# EAGLE design noisemaker_3-0 (EAGLE 6.5.0)
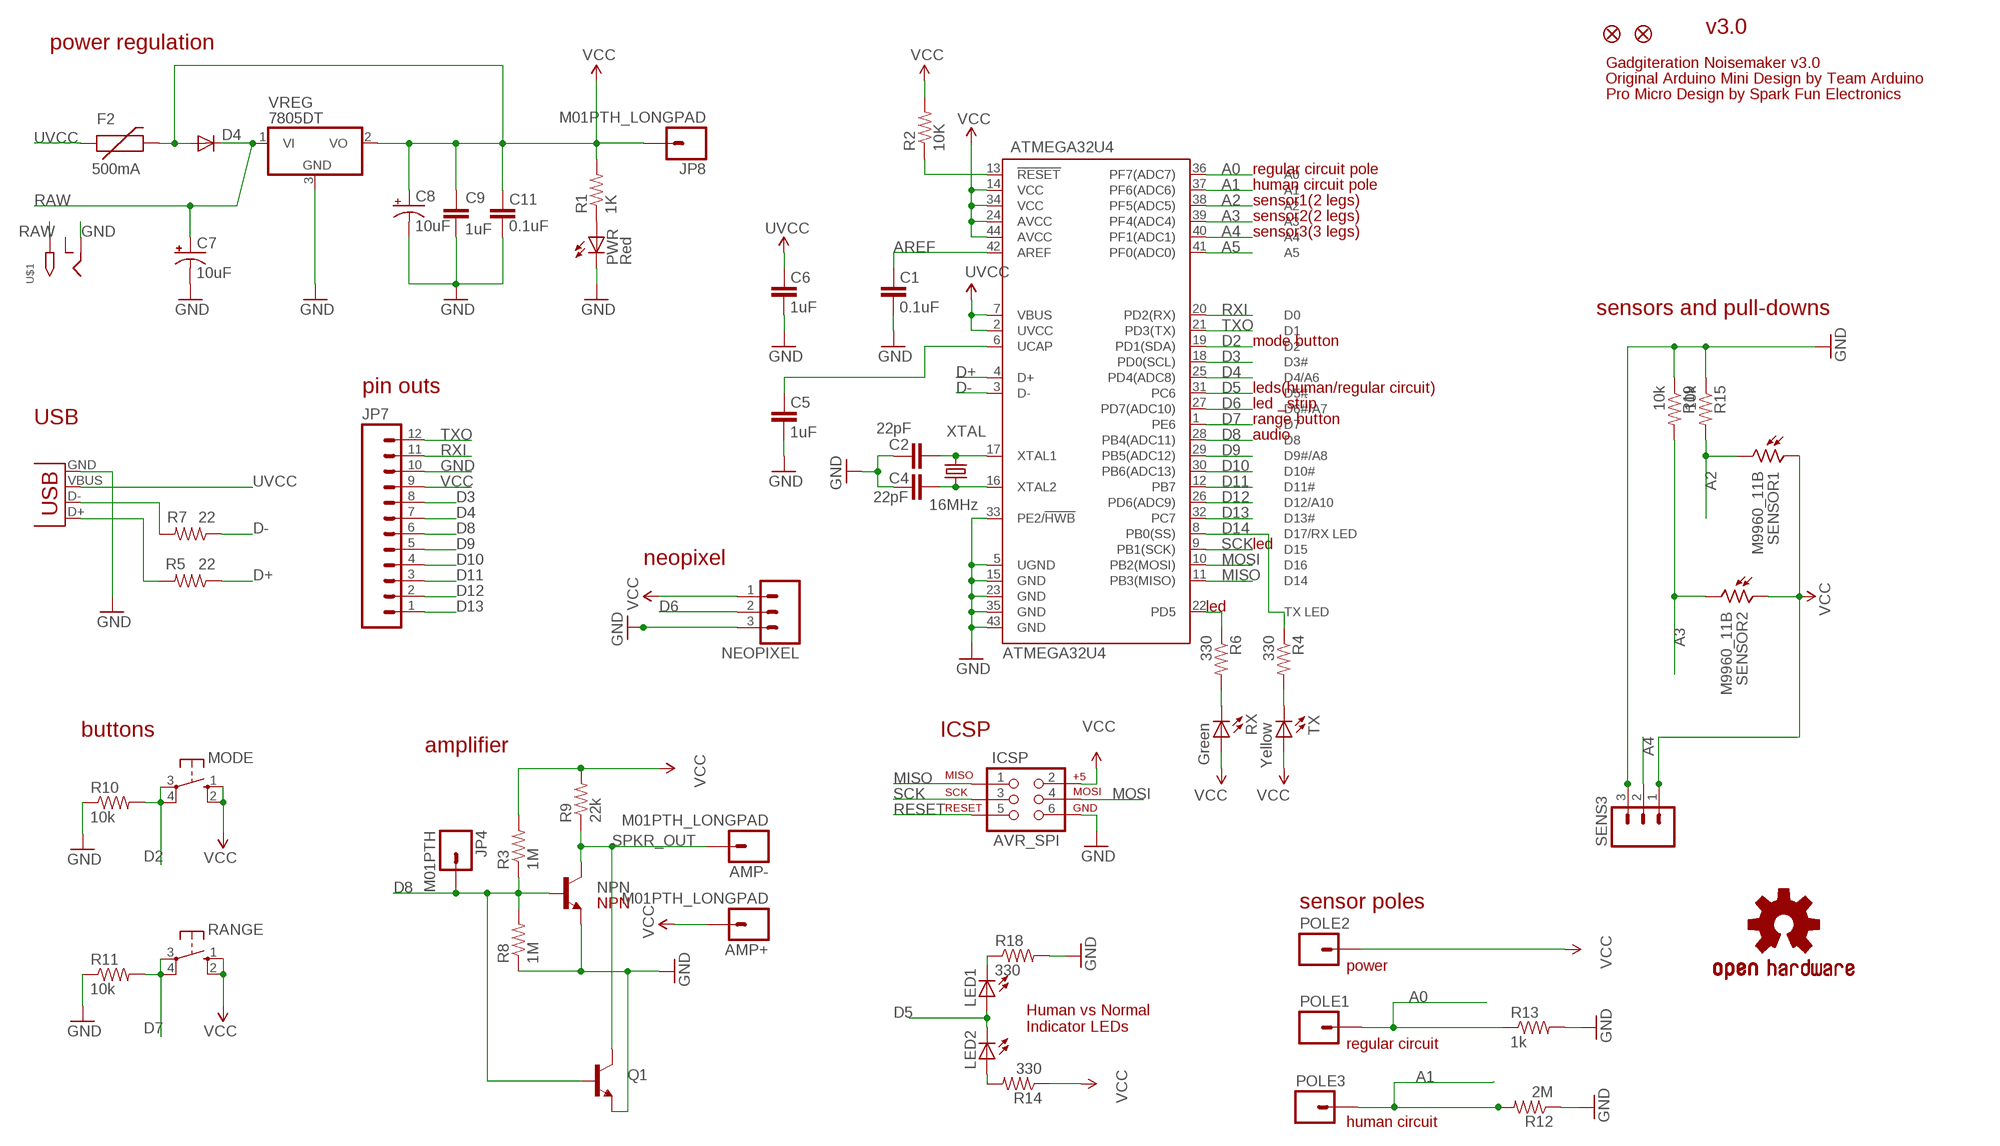
[diagram p0: schematic, sheet 1]

## Parts
AMP+  M01PTH_LONGPAD  [1X01_LONGPAD]
AMP-  M01PTH_LONGPAD  [1X01_LONGPAD]
ATMEGA32U4  ATMEGA32U4  ATMEGA32U4TQFP  [SPARKFUN-DIGITALIC_TQFP44]
C1  0.1uF  CAP1206  [1206]
C2  22pF  CAP0603-CAP  [0603-CAP]
C4  22pF  CAP0603-CAP  [0603-CAP]
C5  1uF  CAP1206  [1206]
C6  1uF  CAP1206  [1206]
C7  10uF  CAP_POL3528-KIT  [EIA3528-KIT]
C8  10uF  CAP_POL3528-KIT  [EIA3528-KIT]
C9  1uF  CAP1206  [1206]
C11  0.1uF  CAP1206  [1206]
D4  DIODESOD  [SOD-323]
F2  500mA  PTCSMD  [PTC-1206]
ICSP  AVR_SPI  AVR_SPI_PRG_6PTH  [2X3]
JP1  FIDUCIALUFIDUCIAL  [MICRO-FIDUCIAL]
JP2  FIDUCIALUFIDUCIAL  [MICRO-FIDUCIAL]
JP3  USB-B  USBPTH  [USB-B-PTH]
JP4  M01PTH  [1X01]
JP7  M12PTH  [1X12]
JP8  M01PTH_LONGPAD  [1X01_LONGPAD]
LED1  LED3MM  [LED3MM]
LED2  LED3MM  [LED3MM]
LOGO1  OSHW-LOGOM  [OSHW-LOGO-M]
MODE  10-XX  [B3F-10XX]
NEOPIXEL  M03LONGPADS  [1X03_LONGPADS]
NPN  TRANSISTOR_NPNSOT23-3  [SOT23-3]
POLE1  M01PTH_LONGPAD  [1X01_LONGPAD]
POLE2  M01PTH_LONGPAD  [1X01_LONGPAD]
POLE3  M01PTH_LONGPAD  [1X01_LONGPAD]
PWR  Red  LEDCHIPLED_1206  [CHIPLED_1206]
Q1  TRANSISTOR_NPNTO-92-AMMO  [TO-92-AMMO]
R1  1K  RESISTOR1206  [1206]
R2  10K  RESISTOR1206  [1206]
R3  1M  RESISTOR1206  [1206]
R4  330  RESISTOR1206  [1206]
R5  22  RESISTOR1206  [1206]
R6  330  RESISTOR1206  [1206]
R7  22  RESISTOR1206  [1206]
R8  1M  RESISTOR1206  [1206]
R9  22k  RESISTOR1206  [1206]
R10  10k  RESISTOR1206  [1206]
R11  10k  RESISTOR1206  [1206]
R12  2M  RESISTOR1206  [1206]
R13  1k  RESISTOR1206  [1206]
R14  330  RESISTOR1206  [1206]
R15  10k  RESISTOR1206  [1206]
R18  330  RESISTOR1206  [1206]
R19  10k  RESISTOR1206  [1206]
RANGE  10-XX  [B3F-10XX]
RX  Green  LEDCHIPLED_1206  [CHIPLED_1206]
SENS3  M03POGO_PIN_HOLES_ONLY  [1X03_PP_HOLES_ONLY]
SENSOR1  M9960_11B  [M9960]
SENSOR2  M9960_11B  [M9960]
TX  Yellow  LEDCHIPLED_1206  [CHIPLED_1206]
U$1  2.1MMJACKTHM  [PJ-102A]
VREG  7805DT  [TO252]
XTAL  16MHz  CRYSTAL5X3  [CRYSTAL-SMD-5X3]

## Nets
A0: ATMEGA32U4.36(PF7(ADC7)) POLE1.1 R13.1
A1: ATMEGA32U4.37(PF6(ADC6)) POLE3.1 R12.2
A2: ATMEGA32U4.38(PF5(ADC5)) R15.2 SENSOR1.2
A3: ATMEGA32U4.39(PF4(ADC4)) R19.2 SENSOR2.2
A4: ATMEGA32U4.40(PF1(ADC1)) SENS3.2
A5: ATMEGA32U4.41(PF0(ADC0))
AREF: ATMEGA32U4.42(AREF) C1.2
D2: ATMEGA32U4.19(PD1(SDA)) MODE.3(P) MODE.4(P1) R10.2
D3: ATMEGA32U4.18(PD0(SCL)) JP7.8
D4: ATMEGA32U4.25(PD4(ADC8)) JP7.7
D5: ATMEGA32U4.31(PC6) LED1.A LED2.K(C)
D6: ATMEGA32U4.27(PD7(ADC10)) NEOPIXEL.2
D7: ATMEGA32U4.1(PE6) R11.2 RANGE.3(P) RANGE.4(P1)
D8: ATMEGA32U4.28(PB4(ADC11)) JP4.1 JP7.6 NPN.1(B) Q1.2(B) R3.1 R8.2
D9: ATMEGA32U4.29(PB5(ADC12)) JP7.5
D10: ATMEGA32U4.30(PB6(ADC13)) JP7.4
D11: ATMEGA32U4.12(PB7) JP7.3
D12: ATMEGA32U4.26(PD6(ADC9)) JP7.2
D13: ATMEGA32U4.32(PC7) JP7.1
D14: ATMEGA32U4.8(PB0(SS)) R4.1
D+: ATMEGA32U4.4(D+) R5.1
D-: ATMEGA32U4.3(D-) R7.1
GND [vcc]: ATMEGA32U4.5(UGND) ATMEGA32U4.15(GND) ATMEGA32U4.23(GND) ATMEGA32U4.33(PE2/!HWB) ATMEGA32U4.35(GND) ATMEGA32U4.43(GND) C1.1 C2.2 C4.2 C5.1 C6.1 C7.C(-) C8.C(-) C9.2 C11.1 ICSP.6 JP3.GND JP7.10 NEOPIXEL.3 NPN.2(E) PWR.C Q1.1(E) R8.1 R10.1 R11.1 R12.1 R13.2 R15.1 R18.2 R19.1 SENS3.3 U$1.RING VREG.3(GND)
MISO: ATMEGA32U4.11(PB3(MISO)) ICSP.1
MOSI: ATMEGA32U4.10(PB2(MOSI)) ICSP.4
N$1: ATMEGA32U4.16(XTAL2) C4.1 XTAL.1
N$2: ATMEGA32U4.17(XTAL1) C2.1 XTAL.3
N$4: ATMEGA32U4.6(UCAP) C5.2
N$5: R4.2 TX.C
N$7: R6.2 RX.C
N$8: JP3.D+ R5.2
N$9: JP3.D- R7.2
N$10: PWR.A R1.1
N$12: LED1.K(C) R18.1
N$13: LED2.A R14.2
RAW [vcc]: C7.A(+) D4.1(C) U$1.TIP VREG.1(VI)
RESET: ATMEGA32U4.13(!RESET) ICSP.5 R2.1
RXI: ATMEGA32U4.20(PD2(RX)) JP7.11
SCK: ATMEGA32U4.9(PB1(SCK)) ICSP.3
SPKR_OUT: AMP-.1 NPN.3(C) Q1.3(C) R9.1
TXLED: ATMEGA32U4.22(PD5) R6.1
TXO: ATMEGA32U4.21(PD3(TX)) JP7.12
UVCC: ATMEGA32U4.2(UVCC) ATMEGA32U4.7(VBUS) C6.2 F2.1 JP3.VBUS
VCC: AMP+.1 ATMEGA32U4.14(VCC) ATMEGA32U4.24(AVCC) ATMEGA32U4.34(VCC) ATMEGA32U4.44(AVCC) C8.A(+) C9.1 C11.2 D4.2(A) F2.2 ICSP.2 JP7.9 JP8.1 MODE.1(S) MODE.2(S1) NEOPIXEL.1 POLE2.1 R1.2 R2.2 R3.2 R9.2 R14.1 RANGE.1(S) RANGE.2(S1) RX.A SENS3.1 SENSOR1.1 SENSOR2.1 TX.A VREG.2(VO)
Unconnected: U$1.RING_SW

## Notes on the sheet
- v3.0
- power regulation
- Gadgiteration Noisemaker v3.0
- Original Arduino Mini Design by Team Arduino
- Pro Micro Design by Spark Fun Electronics
- regular circuit pole
- human circuit pole
- sensor1(2 legs)
- sensor2(2 legs)
- sensor3(3 legs)
- sensors and pull-downs
- mode button
- pin outs | leds(human/regular circuit)
- led _strip
- USB | range button
- audio
- led
- neopixel
- led
- buttons | ICSP
- amplifier
- NPN | sensor poles
- power
- Human vs Normal 
  Indicator LEDs
- regular circuit
- human circuit

## Library data of the parts
AMP+ AMP- JP4 JP8 POLE1-POLE3 = SparkFun-Connectors:M01: Header 1 Standard 1-pin 0.1" header. Use with straight break away headers (SKU : PRT-00116), right angle break away headers (PRT-00553), swiss pins (PRT-00743), machine pins (PRT-00117), and female headers (PRT-00115).
ATMEGA32U4 = SparkFun-DigitalIC:ATMEGA32U4: Atmel 44-pin 8-bit Microcontroller with 32KBytes of ISP Flash and USB Controller
C1 C5 C6 C9 C11 = SparkFun-Capacitors:CAP: Capacitor Standard 0603 ceramic capacitor, and 0.1" leaded capacitor.
C2 C4 = SparkFun:CAP: Capacitor Standard 0603 ceramic capacitor, and 0.1" leaded capacitor.
C7 C8 = SparkFun-Capacitors:CAP_POL: Capacitor Polarized These are standard SMD and PTH capacitors. Normally 10uF, 47uF, and 100uF in electrolytic and tantalum varieties. Always verify the external diameter of the through hole cap, it varies with capacity, voltage, and manufacturer. The EIA devices should be standard.
D4 = SparkFun:DIODE: Diode These are standard reverse protection diodes and small signal diodes. SMA package can handle up to about 1A. SOD-323 can handle about 200mA. What the SOD-323 package when ordering, there are some mfgs out there that are 5-pin packages.
F2 = SparkFun:PTC: Resettable Fuse PTC Resettable Fuse. Spark Fun Electronics SKU : COM-08357
ICSP = SparkFun:AVR_SPI_PRG_6: AVR ISP 6 Pin This is the reduced ISP connector for AVR programming. Common on Arduino. This footprint will take up less PCB space and can be used with a 10-pin to 6-pin adapter such as SKU: BOB-08508
JP1 JP2 = SparkFun:FIDUCIAL: Fiducial Alignment Points Various fiducial points for machine vision alignment.
JP3 = SparkFun-Connectors:USB: USB Connectors USB-B-PTH is fully proven SKU : PRT-00139/CONN-08278 USB-miniB is fully proven SKU : PRT-00587 USB-A-PCB is untested. USB-A-H is throughly reviewed, but untested. Spark Fun Electronics SKU : PRT-00437 USB-B-SMT is throughly reviewed, but untested. Needs silkscreen touching up. USB-A-S has not been used/tested USB-MB-H has not been used/tested USB-MICROB has been used. CONN-09505; PROD_ID: CONN-08278
JP7 = SparkFun:M12: Header 12 Standard 12-pin 0.1" header. Use with straight break away headers (SKU : PRT-00116), right angle break away headers (PRT-00553), swiss pins (PRT-00743), machine pins (PRT-00117), and female headers (PRT-00115).
LED1 LED2 PWR RX TX = adafruit:LED: LED OSRAM: - CHIPLED LG R971, LG N971, LY N971, LG Q971, LY Q971, LO R971, LY R971 LH N974, LH R974 LS Q976, LO Q976, LY Q976 LO Q996 - Hyper CHIPLED LW Q18S LB Q993, LB Q99A, LB R99A - SideLED LS A670, LO A670, LY A670, LG A670, LP A670 LB A673, LV A673, LT A673, LW A673 LH A674 LY A675 LS A676, LA A676, LO A676, LY A676, LW A676 LS A679, LY A679, LG A679 - Hyper Micro SIDELED® LS Y876, LA Y876, LO Y876, LY Y876 LT Y87S - SmartLED LW L88C, LW L88S LB L89C, LB L89S, LG L890 LS L89K, LO L89K, LY L89K LS L896, LA L896, LO L896, LY L896 - TOPLED LS T670, LO T670, LY T670, LG T670, LP T670 LSG T670, LSP T670, LSY T670, LOP T670, LYG T670 LG T671, LOG T671, LSG T671 LB T673, LV T673, LT T673, LW T673 LH T674 LS T676, LA T676, LO T676, LY T676, LB T676, LH T676, LSB T676, LW T676 LB T67C, LV T67C, LT T67C, LS T67K, LO T67K, LY T67K, LW E67C LS E67B, LA E67B, LO E67B, LY E67B, LB E67C, LV E67C, LT E67C LW T67C LS T679, LY T679, LG T679 LS T770, LO T770, LY T770, LG T770, LP T770 LB T773, LV T773, LT T773, LW T773 LH T774 LS E675, LA E675, LY E675, LS T675 LS T776, LA T776, LO T776, LY T776, LB T776 LHGB T686 LT T68C, LB T68C - Hyper Mini TOPLED® LB M676 - Mini TOPLED Santana® LG M470 LS M47K, LO M47K, LY M47K Source: http://www.osram.convergy.de/
LOGO1 = SparkFun-Aesthetics:OSHW-LOGO: Open Source Hardware Logo This logo indicates the piece of hardware it is found on incorporates a OSHW license and/or adheres to the definition of open source hardware found here: http://freedomdefined.org/OSHW
MODE RANGE = switch-omron:10-XX: OMRON SWITCH
NEOPIXEL SENS3 = SparkFun-Connectors:M03: Header 3 Standard 3-pin 0.1" header. Use with straight break away headers (SKU : PRT-00116), right angle break away headers (PRT-00553), swiss pins (PRT-00743), machine pins (PRT-00117), and female headers (PRT-00115). Molex polarized connector foot print use with SKU : PRT-08232 with associated crimp pins and housings.
NPN Q1 = SparkFun-DiscreteSemi:TRANSISTOR_NPN: Generic NPN BJT. MMBT2222 is the common NPN we use. Double check against datasheet- not all devices are the same!
R1-R15 R18 R19 = SparkFun-Passives:RESISTOR: Resistor Basic schematic elements and footprints for 0603, 1206, and PTH resistors.
SENSOR1 SENSOR2 = photo-elements:M9960_11: Photo Sensor Beacon Light, Photometer Applications Source: http://optoelectronics.perkinelmer.com/content/Datasheets/DTS_M9960.pdf
U$1 = adafruit:2.1MMJACK: 2.1mm x 5.5mm THM DC jack with internal switch. Digikey part #PJ-102A, 4UCON part #05537 2.1mm x 5.5mm SMT DC jack with internal switch. Digikey part #PJ-002A-SMT, 4UCON part #03267 By microbuilder.eu & adafruit.com
VREG = linear:78*: Positive VOLTAGE REGULATOR Source: http://cache.national.com/ds/LM/LM78L05.pdf http://www.fairchildsemi.com/ds/LM/LM7805.pdf
XTAL = SparkFun:CRYSTAL: Crystals Various standard crystals. Proven footprints. Spark Fun Electronics SKU : COM-00534

## Net classes
0 default: width 0.203 mm

## Board
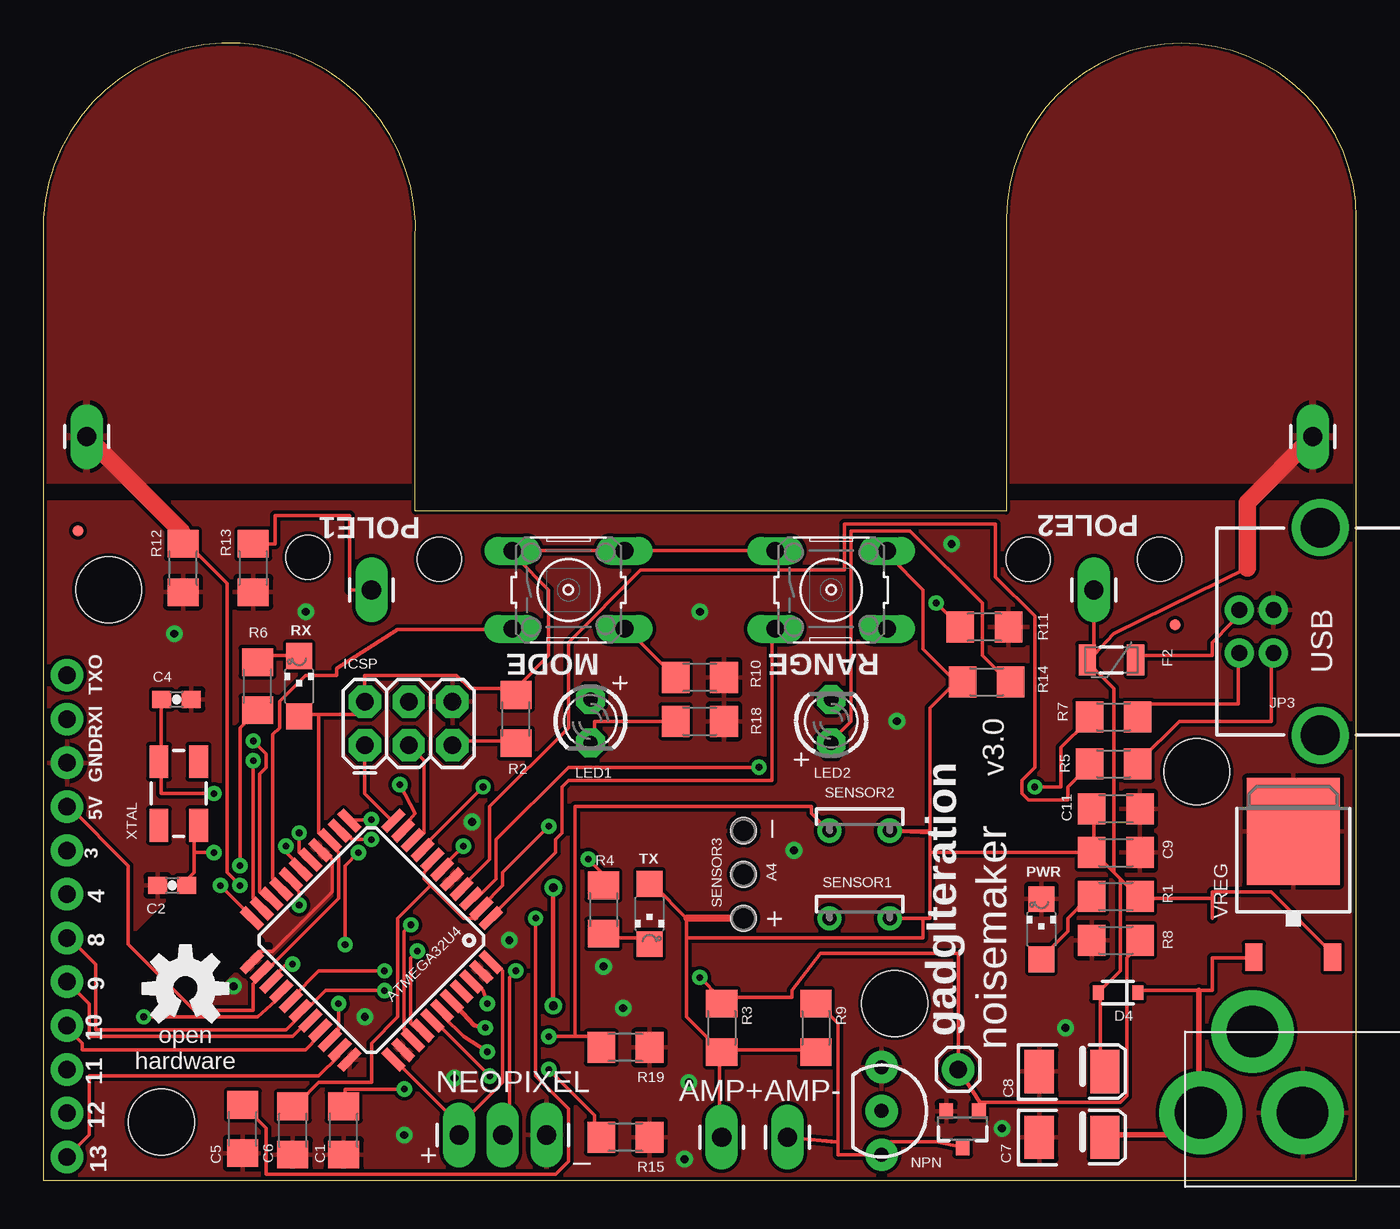
[diagram p1: board, top side]
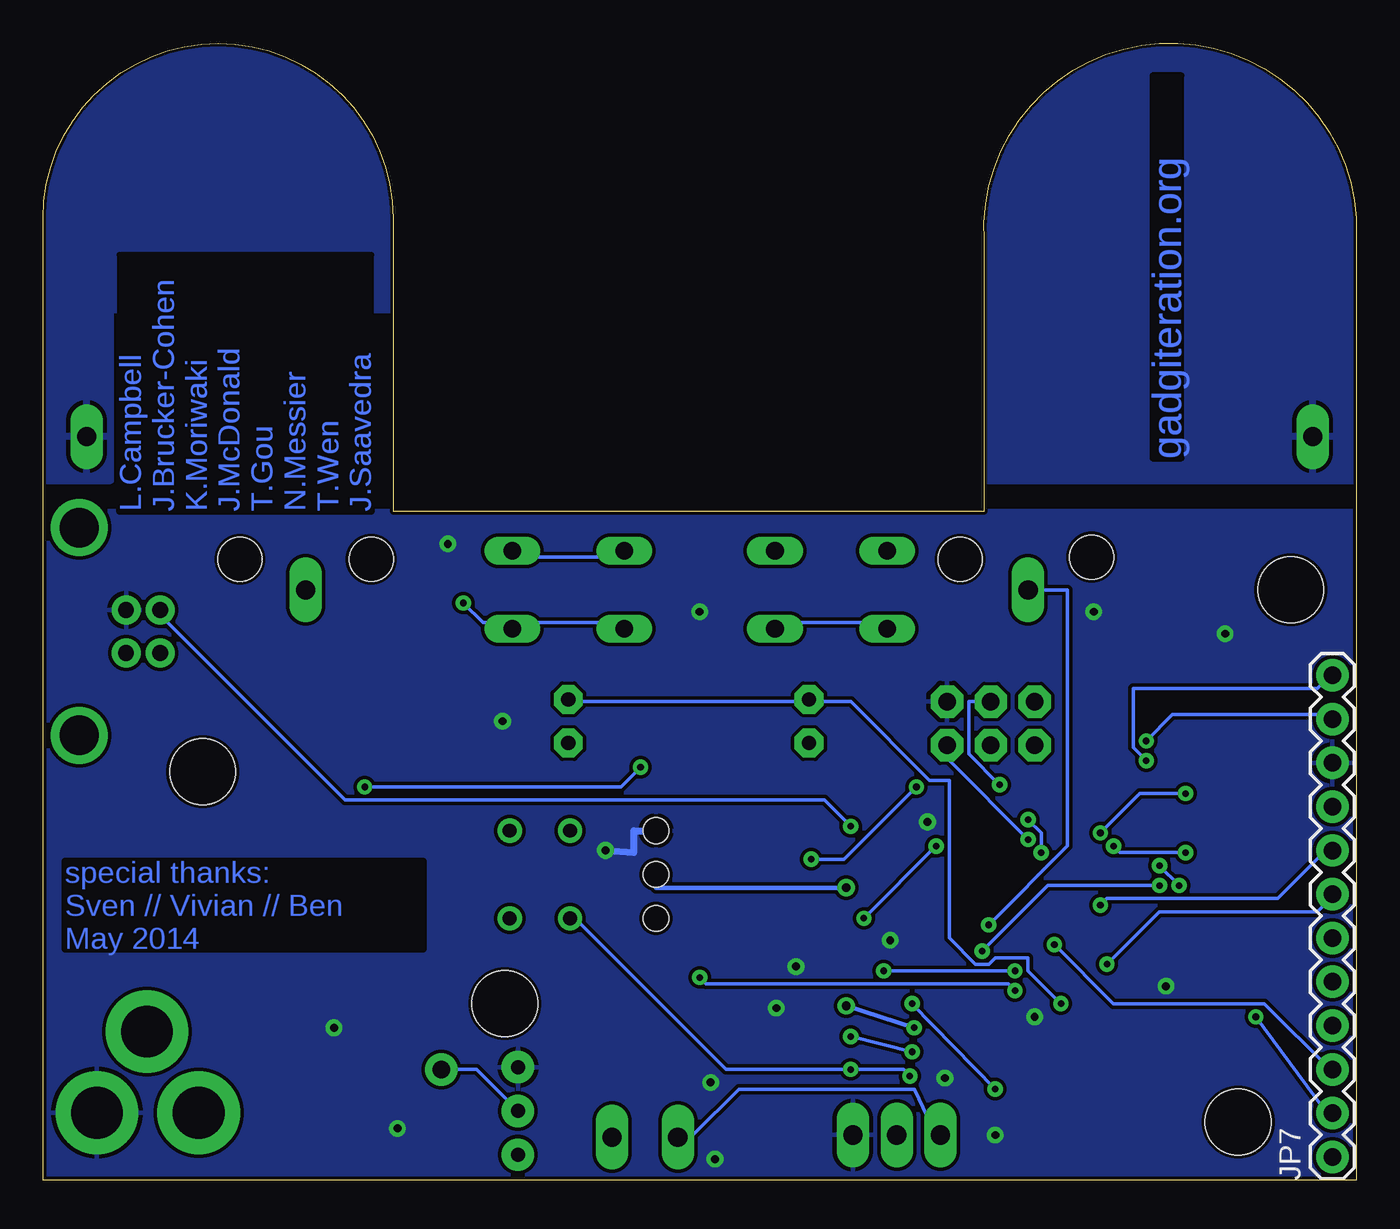
[diagram p2: board, bottom side, seen from below]

Size 76.18 x 65.97 mm. Coordinates in mm from the lower left corner, seen from the top.
Outline: 0,0 76.18,0 76.18,55.8 arc180 55.88,55.8 55.88,38.82 21.59,38.82 21.59,54.53 arc180 0,55.8 0,0
Copper layers (1*16): Top 0.035mm / dielectric 1.5mm / Bottom 0.035mm
Design rules "SparkFun *": minimum track width 8mil, minimum drill 15mil, track to track 7mil, track to pad 7mil, pad to pad 7mil, via to via 7mil, smd to smd 7mil, copper to edge 7mil, drill to drill 7mil, minimum pad ring 12mil, minimum via ring 10mil, stop-mask expansion 4mil, vias tented up to drill 20mil, thermal gap 10mil
Holes 3.81 mm at 3.81,34.25 49.4,10.25 66.92,23.71 6.85,3.39
Holes 2.54 mm at 22.98,36.03 15.36,36.16 57.14,36.03 64.77,36.03
tRestrict: area 9.1,9.6 to 9.3,9.7; area 13.1,13.6 to 13.1,13.6; area 5.4,10.2 to 12.6,17.5

### Footprints (pad centres in the part's own frame; a part is rotated, then mirrored left to right if it is on the bottom)
1X01_LONGPAD = drill 1.118 pad 1.88 long: 1 0,0
SPARKFUN-DIGITALIC_TQFP44 = smd 1.5 x 0.5: 1 -5.8,4; 2 -5.8,3.2; 3 -5.8,2.4; 4 -5.8,1.6; 5 -5.8,0.8; 6 -5.8,0; 7 -5.8,-0.8; 8 -5.8,-1.6; 9 -5.8,-2.4; 10 -5.8,-3.2; 11 -5.8,-4; 23 5.8,-4; 24 5.8,-3.2; 25 5.8,-2.4; 26 5.8,-1.6; 27 5.8,-0.8; 28 5.8,0; 29 5.8,0.8; 30 5.8,1.6; 31 5.8,2.4; 32 5.8,3.2; 33 5.8,4 | smd 0.5 x 1.5: 12 -4,-5.8; 13 -3.2,-5.8; 14 -2.4,-5.8; 15 -1.6,-5.8; 16 -0.8,-5.8; 17 0,-5.8; 18 0.8,-5.8; 19 1.6,-5.8; 20 2.4,-5.8; 21 3.2,-5.8; 22 4,-5.8; 34 4,5.8; 35 3.2,5.8; 36 2.4,5.8; 37 1.6,5.8; 38 0.8,5.8; 39 0,5.8; 40 -0.8,5.8; 41 -1.6,5.8; 42 -2.4,5.8; 43 -3.2,5.8; 44 -4,5.8
1206 = smd 1.6 x 1.8: 1 -1.4,0; 2 1.4,0
0603-CAP = smd 1.1 x 1: 1 -0.85,0; 2 0.85,0
EIA3528-KIT = smd 1.7 x 2.5: A 1.9,0; C -1.9,0
SOD-323 = smd 0.63 x 0.83: 1 -1.15,0; 2 1.15,0
PTC-1206 = smd 1 x 1.8: 1 -1.4,0; 2 1.4,0
2X3 = drill 1.016 pad 1.88 octagon: 1 0,0; 2 0,2.54; 3 2.54,0; 4 2.54,2.54; 5 5.08,0; 6 5.08,2.54
MICRO-FIDUCIAL = smd 0.635 x 0.635: 1 0,0
USB-B-PTH = drill 0.914 pad 1.676: D+ 0,1.25; D- 1.981,1.25; GND 0,-1.25; VBUS 1.981,-1.25 | drill 2.286: S1 -2.718,-6.02; S2 -2.718,6.02
1X01 = drill 1.016 pad 1.88: 1 0,0
1X12 = drill 1.016 pad 1.88: 1 0,0; 2 2.54,0; 3 5.08,0; 4 7.62,0; 5 10.16,0; 6 12.7,0; 7 15.24,0; 8 17.78,0; 9 20.32,0; 10 22.86,0; 11 25.4,0; 12 27.94,0
LED3MM = drill 0.813 pad 1.676 octagon: A -1.27,0; K 1.27,0
B3F-10XX = drill 1.016 long: 1 -3.251,2.261; 2 3.251,2.261; 3 -3.251,-2.261; 4 3.251,-2.261
1X03_LONGPADS = drill 1.118 pad 1.88 long: 1 0,0; 2 2.54,0; 3 5.08,0
SOT23-3 = smd 0.8 x 0.9: 1 -0.95,-1; 2 0.95,-1; 3 0,1.1
CHIPLED_1206 = smd 1.5 x 1.5: A 0,-1.75; C 0,1.75
TO-92-AMMO = drill 0.813 pad 1.88: 1 -2.54,0; 2 0,0; 3 2.54,0
1X03_PP_HOLES_ONLY = drill 0.9 pad 0.813: 1 0,0; 2 2.54,0; 3 5.08,0 | hole 1.473: 0,0; 2.54,0; 5.08,0
M9960 = drill 0.8 pad 1.4: 1 -1.75,0; 2 1.75,0
PJ-102A = drill 3 pad 4.8: RING 0.1,-3.39; RING_SW -4.6,-6.29; TIP 0.1,-9.29
TO252 = smd 1 x 1.6: 1 -2.28,-4.8; 2 2.28,-4.8 | smd 5.4 x 6.2: 3 0,2.5
CRYSTAL-SMD-5X3 = smd 1.9 x 1.1: 1 -1.85,-1.15; 2 1.85,-1.15; 3 1.85,1.15; 4 -1.85,1.15

### Placement (x,y rotation side)
AMP+  39.36,2.5 0 top
AMP-  43.17,2.5 0 top
ATMEGA32U4  19.05,13.93 225 top
C1  17.43,2.9 90 top
C2  7.49,17.11 180 top
C4  7.74,27.9 0 top
C5  11.58,2.98 90 top
C6  14.49,2.9 90 top
C7  59.68,2.5 0 top
C8  59.68,6.31 0 top
C9  62.22,19.01 0 top
C11  62.22,21.55 180 top
D4  62.35,10.88 180 top
F2  61.97,30.19 180 top
ICSP  18.66,25.23 0 top
JP1  2.03,37.68 0 top
JP2  65.65,32.22 0 top
JP3  71.37,31.84 180 top
JP4  53.08,6.44 0 top
JP7  1.39,1.36 90 bottom
JP8  73.66,43.14 0 top
LED1  31.75,26.63 270 top
LED2  45.71,26.63 90 top
LOGO1  8.25,11.14 0 top
MODE  30.48,34.25 0 top
NEOPIXEL  24.12,2.63 0 top
NPN  53.34,3.01 180 top
POLE1  19.05,34.25 0 top
POLE2  60.95,34.25 0 top
POLE3  2.54,43.14 0 top
PWR  57.91,14.57 0 top
Q1  48.64,4.03 270 top
R1  62.22,16.47 0 top
R2  27.43,26.76 90 top
R3  39.36,8.85 270 top
R4  32.51,15.71 270 top
R5  62.1,24.16 0 top
R6  12.44,28.66 90 top
R7  62.1,26.89 0 top
R8  62.22,13.93 0 top
R9  44.83,8.85 270 top
R10  38.09,29.17 180 top
R11  54.6,32.09 180 top
R12  8.12,35.52 90 top
R13  12.19,35.52 270 top
R14  54.73,28.92 0 top
R15  33.78,2.5 180 top
R18  38.09,26.63 0 top
R19  33.78,7.71 180 top
RANGE  45.71,34.25 0 top
RX  14.85,28.66 0 top
SENS3  40.63,15.2 90 top
SENSOR1  47.37,15.2 180 top
SENSOR2  47.37,20.28 180 top
TX  35.17,15.46 180 top
U$1  76.45,4.03 270 top
VREG  72.51,17.74 0 top
XTAL  7.87,22.44 270 top

### Tracks (layer width: path | path; a pad name or v marks a point on that pad's centre or on a via)
A0  (via drill 0.38)
  Top 0.203: v21.33,14.82 20.95,14.44 20.95,8.72 21.33,8.34 ATMEGA32U4.36 | POLE1.1 17.78,34.25 17.78,38.57 13.46,38.57 13.46,36.92 R13.1
  Bottom 0.203: v21.33,14.82 16.76,19.39 16.76,34.25 POLE1.1
A1  (via drill 0.38)
  Top 0.203: v21.71,13.3 21.33,12.92 21.33,9.11 21.71,8.72 ATMEGA32U4.37 | v11.42,17.11 10.66,17.87 10.66,34.63 8.38,36.92 R12.2 8,37.3 8,37.68
  Top 1.016: 8,37.68 POLE3.1
  Bottom 0.203: v21.71,13.3 17.9,17.11 v11.42,17.11
  pour Top: -3.81,68.54 25.39,68.54 25.39,40.6 -3.81,40.6
  pour Bottom: -5.08,69.81 27.94,69.81 27.94,40.6 -5.08,40.6
A2  (via drill 0.38)
  Top 0.203: v25.9,6.06 22.86,9.11 ATMEGA32U4.38 | v29.33,6.44 32,3.77 32,2.63 R15.2
  Bottom 0.203: v25.9,6.06 26.28,6.44 v29.33,6.44 36.57,6.44 45.33,15.2 SENSOR1.2
A3  (via drill 0.38)
  Top 0.203: v25.78,7.46 24.38,8.34 23.24,9.49 ATMEGA32U4.39 | 30.86,8.34 32,8.34 32,7.96 R19.2 | 30.86,8.34 v29.33,8.34 | 30.86,8.34 30.86,21.68 44.57,21.68 44.57,21.3 45.33,20.54 SENSOR2.2
  Bottom 0.203: v29.33,8.34 v25.78,7.46
A4  (via drill 0.38, 0.5)
  Top 0.254: ATMEGA32U4.40 25.01,9 v25.65,8.85 | v29.59,10.12 v29.59,16.98
  Bottom 0.254: v25.65,8.85 v29.59,10.12 | v29.59,16.98 40.63,16.98 SENS3.2
AREF  (via drill 0.38)
  Top 0.203: v25.78,10.25 25.52,11.01 25.14,11.39 ATMEGA32U4.42 | v20.95,5.3 17.52,5.3 17.52,4.53 C1.2
  Bottom 0.203: v20.95,5.3 v25.78,10.25
D2
  Top 0.203: R10.2 36.57,29.3 33.9,31.97 MODE.4 | ATMEGA32U4.19 13.71,17.11 13.33,17.49 13.33,25.87 13.71,26.25 13.71,27.77 15.23,29.3 17.01,29.3 17.01,29.68 20.57,31.97 27.05,31.97 MODE.3
  Bottom 0.203: MODE.4 33.52,32.35 27.43,32.35 MODE.3
D3  (via drill 0.38)
  Top 0.203: v14.85,15.96 14.85,16.73 14.47,17.11 ATMEGA32U4.18
  Bottom 0.203: v14.85,15.96 14.47,16.34 4.57,16.34 1.9,19.01 1.52,19.01 JP7.8
D4  (via drill 0.38)
  Top 0.203: v14.47,12.54 14.09,12.54 13.33,11.77 ATMEGA32U4.25
  Bottom 0.203: v14.47,12.54 11.42,15.58 2.28,15.58 1.52,16.34 JP7.7
D5  (via drill 0.38)
  Top 0.203: v17.14,10.25 17.14,8.72 16.76,8.34 ATMEGA32U4.31
  Bottom 0.203: v17.14,10.25 19.05,12.15 19.05,12.92 20.95,12.92 21.33,12.54 22.09,12.54 23.62,14.06 23.62,23.2 24.76,23.2 29.33,27.77 31.62,27.77 LED1.A 32,27.77 45.71,27.77 LED2.K
D6  (via drill 0.38)
  Top 0.203: v19.81,12.15 16,12.15 14.47,10.63 ATMEGA32U4.27 | v27.43,12.15 27.05,11.77 27.05,3.01 NEOPIXEL.2
  Bottom 0.203: v27.43,12.15 v19.81,12.15
D7  (via drill 0.38)
  Top 0.203: v51.81,33.49 52.95,32.35 R11.2 | ATMEGA32U4.1 26.28,15.58 29.71,19.01 29.71,19.77 30.09,20.16 30.09,22.82 30.48,23.2 42.29,23.2 42.29,31.97 RANGE.3
  Bottom 0.203: v51.81,33.49 50.67,32.35 49.14,32.35 RANGE.4 48.76,32.35 42.67,32.35 RANGE.3
D8  (via drill 0.38)
  Top 0.203: JP7.6 1.52,14.06 3.04,12.54 3.04,8.72 14.09,8.72 14.85,9.49 ATMEGA32U4.28 15.23,9.87 16.38,11.01 v19.81,11.01 | 54.35,4.53 JP4.1 53.08,13.17 45.08,13.17 43.43,11.01 43.43,10.63 39.62,10.63 R3.1 39.24,10.63 v38.09,11.77 | 54.35,4.53 54.35,4.28 NPN.1 | 54.35,4.53 62.48,4.53 62.86,4.92 62.86,12.92 63.62,13.68 R8.2
  Bottom 0.203: v19.81,11.01 20.19,11.39 37.71,11.39 v38.09,11.77 | Q1.2 51.05,6.44 JP4.1
D9
  Top 0.203: JP7.5 2.66,10.25 2.66,8.34 14.47,8.34 15.23,9.11 ATMEGA32U4.29
D10
  Top 0.203: ATMEGA32U4.30 16,8.34 15.23,7.58 2.28,7.58 2.28,7.96 1.52,8.72 JP7.4
D11  (via drill 0.38)
  Top 0.203: v19.05,20.92 17.9,20.92 ATMEGA32U4.12 | v18.28,19.01 17.52,18.25 v17.52,13.68
  Bottom 0.203: v19.05,20.92 18.28,20.16 v18.28,19.01 | v17.52,13.68 14.09,10.25 5.33,10.25 1.52,6.44 JP7.3
D12  (via drill 0.38)
  Top 0.203: v5.84,9.49 12.44,9.49 13.71,10.63 ATMEGA32U4.26
  Bottom 0.203: v5.84,9.49 1.9,4.15 1.52,4.15 JP7.2
D13
  Top 0.203: JP7.1 2.66,2.63 2.66,6.06 16,6.06 17.14,7.2 ATMEGA32U4.32
D14  (via drill 0.38)
  Top 0.203: v25.52,22.82 22.09,19.39 ATMEGA32U4.8 | v31.62,18.63 32.38,17.87 32.38,17.49 R4.1
  Bottom 0.203: v25.52,22.82 29.71,18.63 v31.62,18.63
D+
  Top 0.203: ATMEGA32U4.4 24.38,17.11 25.9,18.63 25.9,21.68 30.48,26.25 30.48,31.2 34.67,35.4 46.48,35.4 46.48,38.06 55.24,38.06 55.24,35.01 57.53,32.73 57.53,23.96 56.76,23.2 56.76,22.44 57.14,22.06 59.43,22.06 59.43,22.82 60.57,23.96 R5.1
D-  (via drill 0.38)
  Top 0.203: v41.52,23.96 30.48,23.96 26.28,19.77 26.28,17.49 25.14,16.34 ATMEGA32U4.3 | v57.53,22.82 59.05,22.82 59.05,25.11 60.57,26.63 R7.1
  Bottom 0.203: v41.52,23.96 42.67,22.82 v57.53,22.82
GND  (via drill 0.46)
  Top 0.203: ATMEGA32U4.15 16.38,19.01 16.76,18.63 16.76,16.73 13.33,13.3 12.57,13.3 12.19,12.92 ATMEGA32U4.23 12.19,12.54 12.09,12.63
  Bottom 0.203: 29.33,2.63 NEOPIXEL.3 | 29.33,2.63
  Bottom 0.406: v43.56,19.14 41.9,19.01 41.9,20.28 SENS3.3
  other vias: 7.62,31.71 15.23,32.98 38.09,32.98 49.52,26.63 52.7,36.92 37.46,5.68 33.65,9.99 37.21,1.23 23.87,5.93 20.95,2.63 18.66,9.49 11.04,11.27 24.89,20.79 32.51,12.41 27.05,13.93 55.62,3.01 59.3,8.85
  pour Top (isolate 0.203): -0.01,39.33 93.98,39.33 95.25,-0.04 -0.01,-0.04
  pour Bottom (isolate 0.203): -0.13,38.82 97.66,38.82 97.79,-0.04 -0.01,-0.04
MISO
  Top 0.203: ICSP.1 18.66,22.44 20.19,20.92 ATMEGA32U4.11
MOSI  (via drill 0.38)
  Top 0.203: v20.7,22.95 21.59,21.3 20.95,20.54 ATMEGA32U4.10
  Bottom 0.203: v20.7,22.95 22.47,24.73 22.47,27.77 ICSP.4
N$1  (via drill 0.38)
  Top 0.203: C4.1 6.85,27.77 6.85,24.35 XTAL.1 6.85,23.96 6.85,22.44 v9.9,22.44 | v14.85,20.16 14.85,19.01 15.23,18.63 ATMEGA32U4.16
  Bottom 0.203: v14.85,20.16 12.57,22.44 v9.9,22.44
N$2  (via drill 0.38)
  Top 0.203: 8.76,19.01 8.76,20.54 XTAL.3 | 8.76,19.01 8.76,17.87 8,17.11 C2.1 | v14.09,19.39 14.09,19.01 14.85,18.25 ATMEGA32U4.17 | 8.76,19.01 v9.9,19.01
  Bottom 0.203: v14.09,19.39 13.71,19.01 v9.9,19.01
N$4  (via drill 0.38)
  Top 0.203: v24.38,19.39 23.24,18.25 ATMEGA32U4.6 | v28.57,15.2 28.57,6.06 30.48,4.15 30.48,1.1 29.71,0.34 12.95,0.34 12.95,3.01 11.81,4.15 C5.2
  Bottom 0.203: v28.57,15.2 v24.38,19.39
N$5
  Top 0.203: TX.C 35.05,14.06 32.76,14.06 R4.2
N$7
  Top 0.203: RX.C 14.85,30.44 12.57,30.44 R6.2
N$8
  Top 0.203: R5.2 63.62,24.35 65.91,26.63 71.24,26.63 71.24,30.44 JP3.D+
N$9
  Top 0.203: R7.2 63.62,27.65 69.34,27.65 69.34,30.44 JP3.D-
N$10
  Top 0.203: PWR.A 57.91,12.92 59.43,14.44 59.43,15.2 60.57,16.34 R1.1
N$12
  Top 0.203: R18.1 32,26.63 32,25.49 LED1.K
N$13
  Top 0.203: R14.2 56,28.92 54.48,30.44 54.48,33.49 50.29,37.68 46.86,37.68 46.86,26.63 45.71,25.49 LED2.A
RAW
  Top 0.203: D4.1 63.62,11.01 67.05,11.01 67.81,11.01 67.81,12.92 70.1,12.92 VREG.1 | 61.72,2.63 C7.A
  Top 0.305: 61.72,2.63 67.05,2.63 67.05,4.15 U$1.TIP 67.05,4.53 67.05,11.01
RESET  (via drill 0.38)
  Top 0.203: v19.05,19.77 17.9,19.77 17.52,20.16 ATMEGA32U4.13 | R2.1 27.43,25.49 24,25.49 ICSP.5
  Bottom 0.203: v19.05,19.77 23.62,24.35 23.62,25.11 ICSP.5
RXI  (via drill 0.38)
  Top 0.203: v12.19,25.49 12.95,24.73 12.95,23.96 12.57,23.58 12.57,16.73 12.95,16.34 ATMEGA32U4.20
  Bottom 0.203: v12.19,25.49 10.66,27.01 1.52,27.01 JP7.11
SCK
  Top 0.203: ICSP.3 22.09,24.35 22.09,20.16 21.71,19.77 ATMEGA32U4.9
SPKR_OUT
  Top 0.203: 46.1,2.25 45.71,2.25 AMP-.1 46.1,2.25 | NPN.3 51.81,2.25 48.76,2.25 48.76,1.49 Q1.3 46.1,1.49 46.1,2.25 | 46.1,2.25 46.1,9.11 44.95,10.25 R9.1
TXLED  (via drill 0.38)
  Top 0.203: v10.28,17.11 11.81,15.58 ATMEGA32U4.22 | v11.42,18.25 11.42,26.25 12.19,27.01 R6.1
  Bottom 0.203: v11.42,18.25 v10.28,17.11
TXO  (via drill 0.38)
  Top 0.203: v12.19,24.35 12.19,16.34 12.57,15.96 ATMEGA32U4.21
  Bottom 0.203: v12.19,24.35 12.95,25.11 12.95,28.54 2.28,28.54 1.52,29.3 JP7.12
UVCC  (via drill 0.38)
  Top 0.203: F2.1 63.62,30.44 67.81,30.44 67.81,31.2 68.96,32.35 JP3.VBUS | 22.47,17.11 24.38,15.2 25.14,15.2 25.14,15.58 ATMEGA32U4.2 25.52,15.96 26.67,17.11 26.67,17.87 v29.33,20.54 | 22.47,17.11 22.09,17.49 22.09,17.87 22.47,18.25 ATMEGA32U4.7 | 22.47,17.11 20.57,15.2 20.57,9.49 19.05,7.96 19.05,5.68 16,5.68 14.85,4.53 C6.2
  Bottom 0.203: v29.33,20.54 30.86,22.06 58.67,22.06 68.96,32.35 JP3.VBUS
VCC
  Top 0.203: 27.43,28.54 29.33,30.44 29.33,34.25 27.43,36.16 MODE.1 27.43,36.54 33.52,36.54 MODE.2 33.9,36.54 42.29,36.54 RANGE.1 | 16,27.01 18.66,27.01 ICSP.2 18.66,29.3 24,29.3 24.76,28.54 27.43,28.54 | 16,27.01 14.85,27.01 RX.A | JP7.9 1.52,21.68 4.95,18.25 4.95,13.68 8.76,9.87 12.19,9.87 12.19,11.39 12.57,11.77 ATMEGA32U4.24 12.95,12.15 17.14,16.34 17.14,19.01 16.76,19.39 ATMEGA32U4.14 16.38,19.77 16,20.16 16,27.01 | 27.43,28.54 R2.2 | 24,3.01 24,2.63 NEOPIXEL.1 24,3.01 | 24,3.01 24,3.39 20.57,6.82 ATMEGA32U4.34 | 24,3.01 26.67,5.68 26.67,12.15 26.28,12.54 ATMEGA32U4.44 | 37.33,14.06 37.33,9.49 39.24,7.58 R3.2 | 37.33,14.06 37.33,15.2 35.43,17.11 TX.A | R9.2 44.57,7.58 39.62,7.58 R3.2 | AMP+.1 39.24,2.63 39.24,7.2 R3.2 | POLE2.1 60.95,30.82 60.57,30.44 F2.2 60.57,30.06 | 60.57,30.06 62.1,31.71 69.84,35.52 | C8.A 61.34,6.44 61.34,10.63 D4.2 61.34,11.01 62.48,12.15 62.48,17.49 | 60.95,19.01 60.95,21.3 C11.2 | 67.81,16.34 64,16.34 R1.2 63.62,16.34 62.48,17.49 | 67.81,15.2 67.81,16.34 | 62.48,17.49 62.1,17.87 | 62.1,17.87 60.95,19.01 | 60.95,19.01 C9.1 51.43,19.01 | 52.95,28.92 51.43,27.39 51.43,20.28 | 51.43,20.16 SENSOR2.1 51.43,20.28 | 51.43,20.28 51.43,20.16 | 51.43,20.16 51.43,19.01 | 51.43,19.01 51.43,15.2 SENSOR1.1 51.05,15.2 51.05,14.06 37.33,14.06 | 52.95,28.92 51.05,30.82 51.05,34.25 49.14,36.16 RANGE.2 | 52.95,28.92 R14.1 | 60.57,30.06 62.1,28.54 62.1,17.87 | 67.81,16.34 67.81,16.73 71.24,16.73 74.67,13.3 VREG.2
  Top 0.406: SENS3.1 37.33,15.2
  Top 1.016: 69.84,35.52 69.84,39.33 JP8.1
  Bottom 0.203: NEOPIXEL.1 24.38,2.63 25.65,5.3 35.81,5.3 38.48,2.63 39.24,2.63 AMP+.1 | RANGE.1 42.67,36.16 48.76,36.16 RANGE.2
  pour Bottom: 49.52,69.81 78.73,69.81 76.2,40.6 72.26,40.6 72.26,50.51 49.52,50.51
  pour Top: 50.79,69.81 80.01,69.81 80.01,40.6 50.79,40.6

### Text on the board
Bottom: gadgiteration.org | gadgiteration.org | L.Campbell / J.Brucker-Cohen / K.Moriwaki / J.McDonald / T.Gou / N.Messier / T.Wen / J.Saavedra | L.Campbell / J.Brucker-Cohen / K.Moriwaki / J.McDonald / T.Gou / N.Messier / T.Wen / J.Saavedra | special thanks: / Sven // Vivian // Ben / May 2014
tPlace: TXO | RXI | GND | 5V | 3 | 4 | 8 | 9 | 10 | 11 | 12 | 13
tNames: USB | v3.0 | _ | A4 | SENSOR3 | + | open / hardware | gadgIteration | noisemaker | _ | +
tValues: Valid combinations: | 3.3V Reg / 8MHz | 5V Reg / 16MHz | Mark back accordingly